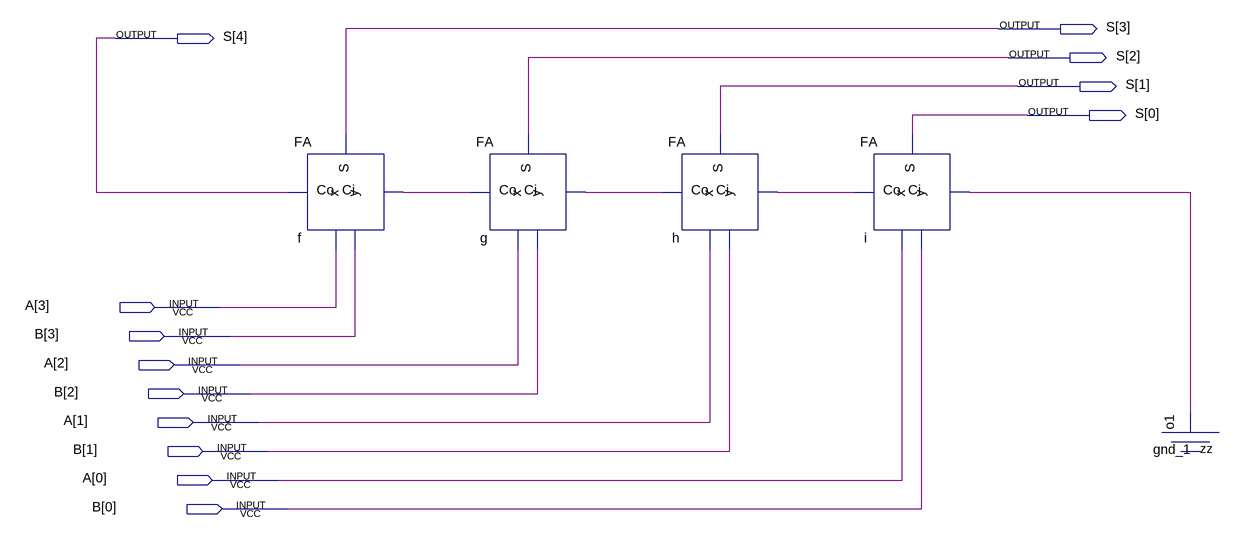
[diagram p0: schematic sheet]
// Quartus schematic FA4.bdf as structural Verilog: 5 symbols, 13 pins
module FA4 (
  input  [3:0] A,
  input  [3:0] B,
  output [4:0] S
);

  wire g_co, h_co, i_co, zz_o1;

  FA f (.Ci(g_co), .x(A[3]), .y(B[3]), .Co(S[4]), .S(S[3]));
  FA g (.Ci(h_co), .x(A[2]), .y(B[2]), .Co(g_co), .S(S[2]));
  FA h (.Ci(i_co), .x(A[1]), .y(B[1]), .Co(h_co), .S(S[1]));
  FA i (.Ci(zz_o1), .x(A[0]), .y(B[0]), .Co(i_co), .S(S[0]));
  gnd_1 zz (.o1(zz_o1));
endmodule
